# Altium schematic sheet Power.SchDoc
size A3; DocumentNumber: 8; SheetNumber: 8; SheetTotal: 8
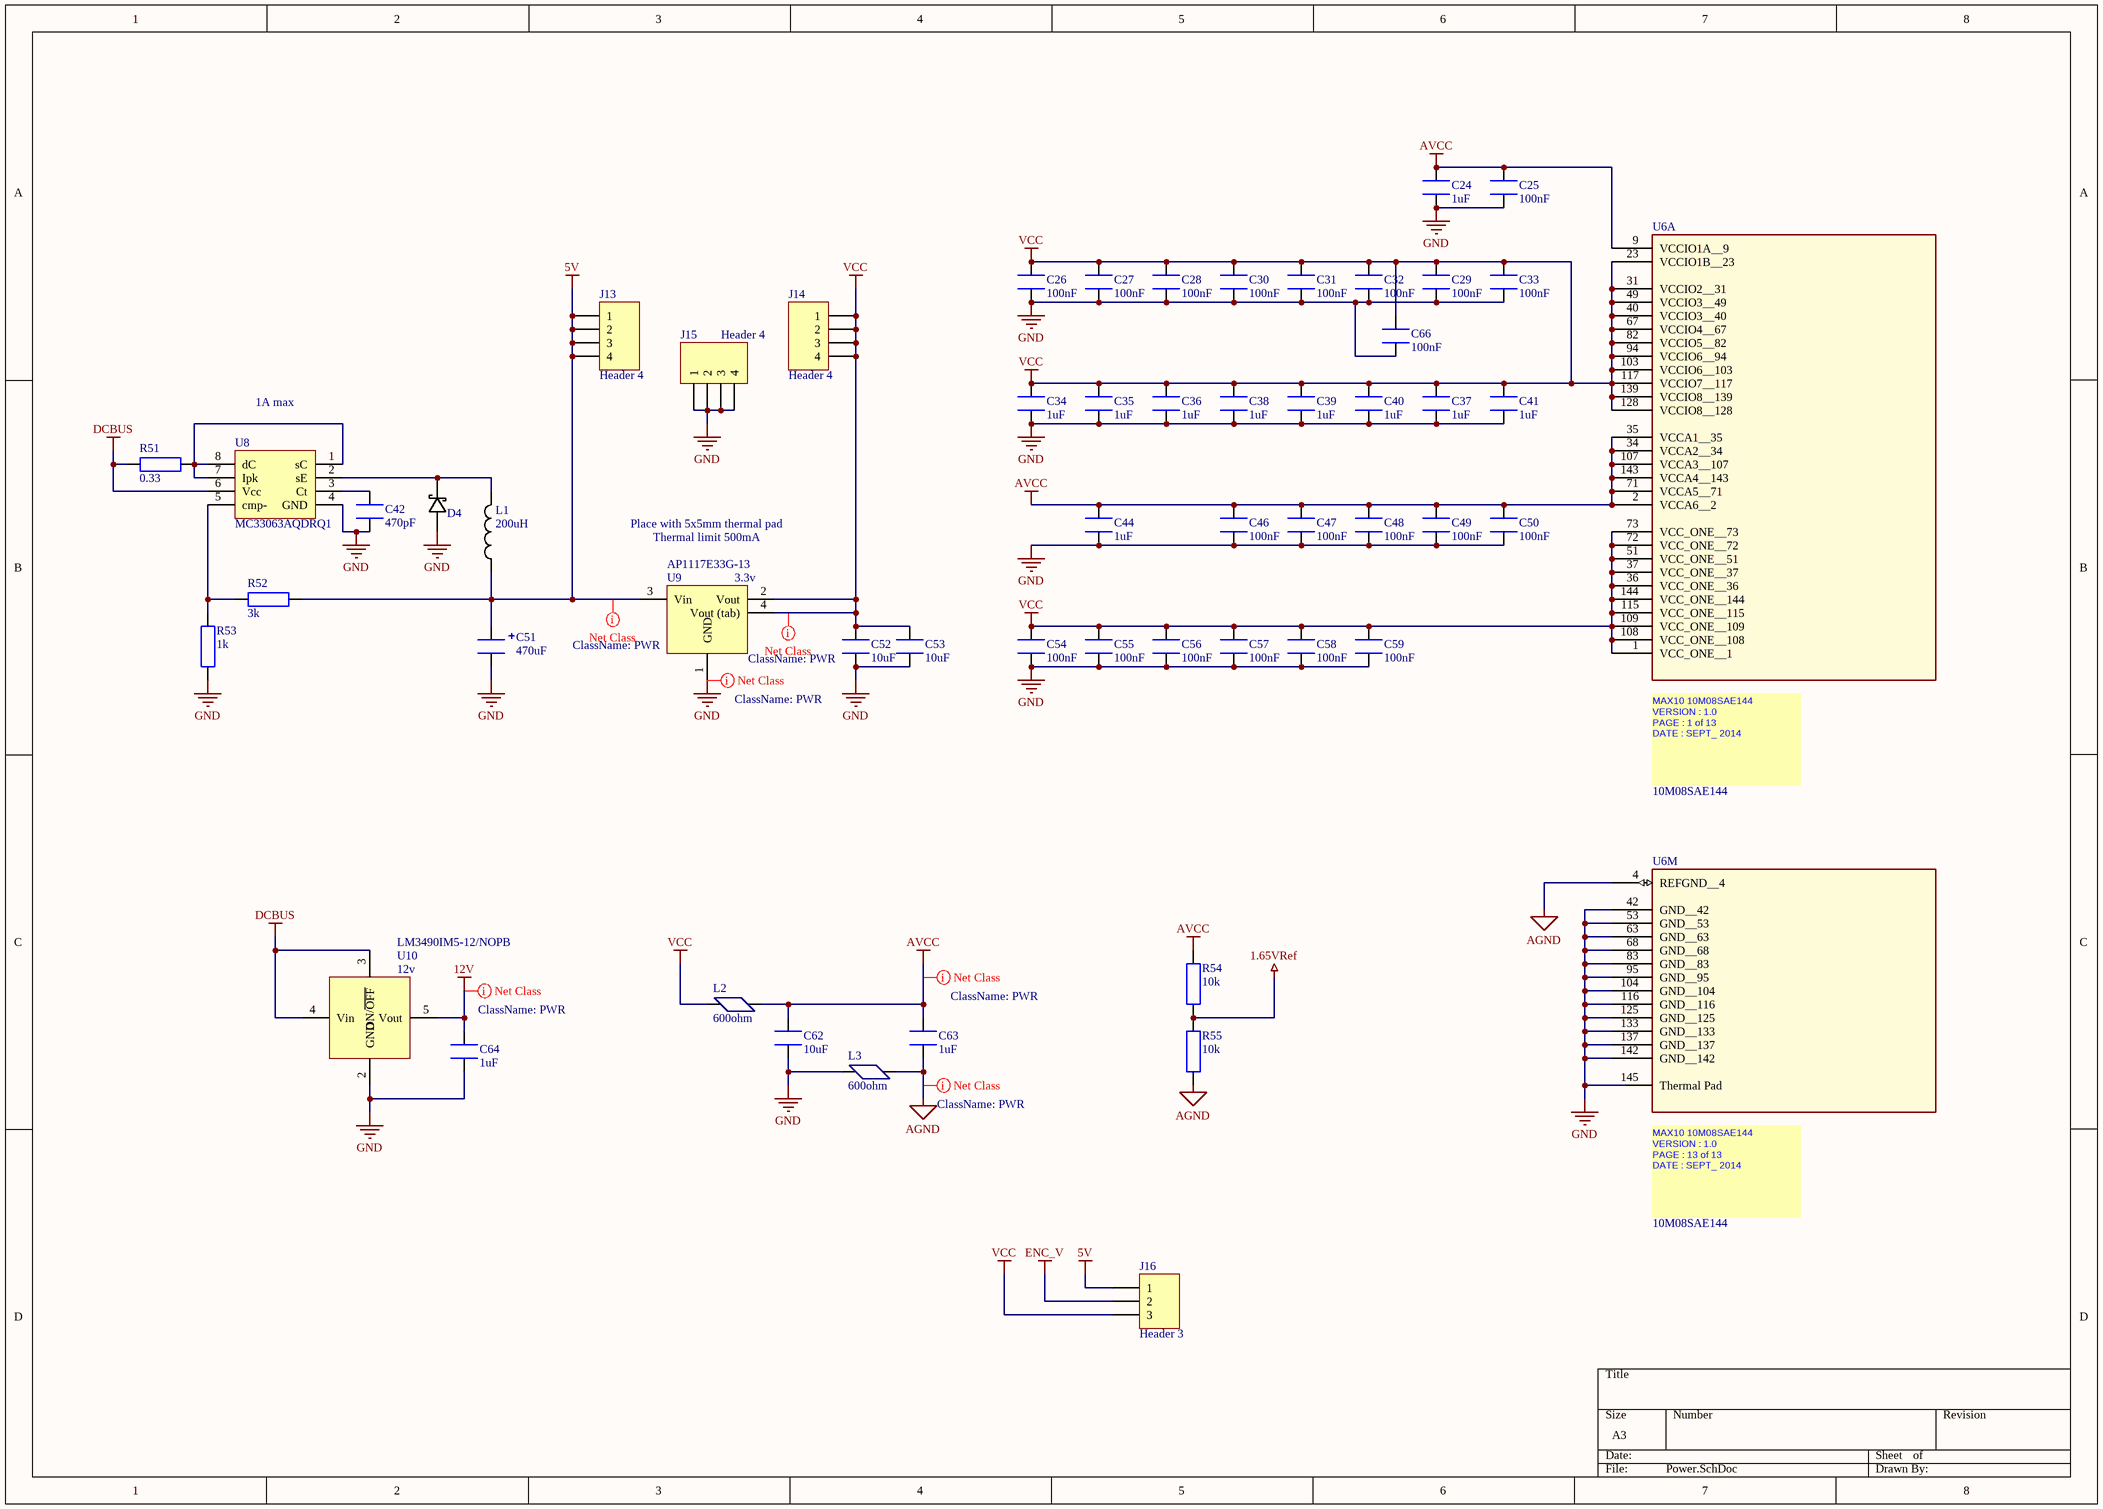
[diagram p0: Power.SchDoc]

## Parts
C24  value 1uF  [1608[0603]]  (hidden comment: MC0603X105K160)
C25  value 100nF  [1608[0603]]  (hidden comment: MC0603B104K160CT)
C26  value 100nF  [1608[0603]]  (hidden comment: MC0603B104K160CT)
C27  value 100nF  [1608[0603]]  (hidden comment: MC0603B104K160CT)
C28  value 100nF  [1608[0603]]  (hidden comment: MC0603B104K160CT)
C29  value 100nF  [1608[0603]]  (hidden comment: MC0603B104K160CT)
C30  value 100nF  [1608[0603]]  (hidden comment: MC0603B104K160CT)
C31  value 100nF  [1608[0603]]  (hidden comment: MC0603B104K160CT)
C32  value 100nF  [1608[0603]]  (hidden comment: MC0603B104K160CT)
C33  value 100nF  [1608[0603]]  (hidden comment: MC0603B104K160CT)
C34  value 1uF  [1608[0603]]  (hidden comment: MC0603X105K160)
C35  value 1uF  [1608[0603]]  (hidden comment: MC0603X105K160)
C36  value 1uF  [1608[0603]]  (hidden comment: MC0603X105K160)
C37  value 1uF  [1608[0603]]  (hidden comment: MC0603X105K160)
C38  value 1uF  [1608[0603]]  (hidden comment: MC0603X105K160)
C39  value 1uF  [1608[0603]]  (hidden comment: MC0603X105K160)
C40  value 1uF  [1608[0603]]  (hidden comment: MC0603X105K160)
C41  value 1uF  [1608[0603]]  (hidden comment: MC0603X105K160)
C42  value 470pF  [1608[0603]]  (hidden comment: MC0603B471K500CT)
C44  value 1uF  [1608[0603]]  (hidden comment: MC0603X105K160)
C46  value 100nF  [1608[0603]]  (hidden comment: MC0603B104K160CT)
C47  value 100nF  [1608[0603]]  (hidden comment: MC0603B104K160CT)
C48  value 100nF  [1608[0603]]  (hidden comment: MC0603B104K160CT)
C49  value 100nF  [1608[0603]]  (hidden comment: MC0603B104K160CT)
C50  value 100nF  [1608[0603]]  (hidden comment: MC0603B104K160CT)
C51  value 470uF  [CAP_ELEC_SIZE_G]  (hidden comment: EEE1CA471P)
C52  value 10uF  [CAPC2012X135N]  (hidden comment: MC0805F106Z100CT)
C53  value 10uF  [CAPC2012X135N]  (hidden comment: MC0805F106Z100CT)
C54  value 100nF  [1608[0603]]  (hidden comment: MC0603B104K160CT)
C55  value 100nF  [1608[0603]]  (hidden comment: MC0603B104K160CT)
C56  value 100nF  [1608[0603]]  (hidden comment: MC0603B104K160CT)
C57  value 100nF  [1608[0603]]  (hidden comment: MC0603B104K160CT)
C58  value 100nF  [1608[0603]]  (hidden comment: MC0603B104K160CT)
C59  value 100nF  [1608[0603]]  (hidden comment: MC0603B104K160CT)
C62  value 10uF  [CAPC2012X135N]  (hidden comment: MC0805F106Z100CT)
C63  value 1uF  [1608[0603]]  (hidden comment: MC0603X105K160)
C64  value 1uF  [1608[0603]]  (hidden comment: MC0603X105K160)
C66  value 100nF  [1608[0603]]  (hidden comment: MC0603B104K160CT)
D4  SS13B  [DO-214AA]  (value not drawn)
J13  Header 4  [HDR1X4]
J14  Header 4  [HDR1X4]
J15  Header 4  [HDR1X4]
J16  Header 3  [HDR1X3]
L1  value 200uH  [Inductor 12x12mm]  (hidden comment: MCSDRH125B-221MHF)
L2  value 600ohm  [FBC2012N]  (hidden comment: 2508056017Y2)
L3  value 600ohm  [FBC2012N]  (hidden comment: 2508056017Y2)
R51  value 0.33  [RESC1608X55N]  (hidden comment: ERJ3RQFR33V)
R52  value 3k  [RESC1608X55N]  (hidden comment: MCMR06X3001FTL)
R53  value 1k  [RESC1608X55N]  (hidden comment: MCMR06X1001FTL)
R54  value 10k  [RESC1608X06L]  (hidden comment: MCMR06X1002FTL)
R55  value 10k  [RESC1608X06L]  (hidden comment: MCMR06X1002FTL)
U6  10M08SAE144  [SQFP50P2200X2200X165_HS-145N]  (parts A,M of 13)
U8  MC33063AQDRQ1  [SO8_N]
U9  AP1117E33G-13  value 3.3v  [SOT223]
U10  LM3490IM5-12/NOPB  value 12v  [SOT23-5]

## Nets
1.65VRef: R54.1 R55.2
5V: C51.1 J13.1 J13.2 J13.3 J13.4 J16.1 L1.1 R52.1 U9.3(Vin)
12V: C64.2 U10.5(Vout)
AGND: C63.1 L3.1 R55.1 U6.4(REFGND__4)
AVCC: C24.2 C25.2 C44.2 C46.2 C47.2 C48.2 C49.2 C50.2 C62.2 C63.2 L2.1 R54.2 U6.2(VCCA6__2) U6.9(VCCIO1A__9) U6.34(VCCA2__34) U6.35(VCCA1__35) U6.71(VCCA5__71) U6.107(VCCA3__107) U6.143(VCCA4__143)
DCBUS: R51.2 U8.6(Vcc) U10.3(ON/~{OFF}) U10.4(Vin)
ENC_V: J16.2
GND: C24.1 C25.1 C26.1 C27.1 C28.1 C29.1 C30.1 C31.1 C32.1 C33.1 C34.1 C35.1 C36.1 C37.1 C38.1 C39.1 C40.1 C41.1 C42.1 C44.1 C46.1 C47.1 C48.1 C49.1 C50.1 C51.2 C52.1 C53.1 C54.1 C55.1 C56.1 C57.1 C58.1 C59.1 C62.1 C64.1 C66.1 D4.A J15.1 J15.2 J15.3 J15.4 L3.2 R53.1 U6.42(GND__42) U6.53(GND__53) U6.63(GND__63) U6.68(GND__68) U6.83(GND__83) U6.95(GND__95) U6.104(GND__104) U6.116(GND__116) U6.125(GND__125) U6.133(GND__133) U6.137(GND__137) U6.142(GND__142) U6.145(Thermal_Pad) U8.4(GND) U9.1(GND) U10.2(GND)
VCC: C26.2 C27.2 C28.2 C29.2 C30.2 C31.2 C32.2 C33.2 C34.2 C35.2 C36.2 C37.2 C38.2 C39.2 C40.2 C41.2 C52.2 C53.2 C54.2 C55.2 C56.2 C57.2 C58.2 C59.2 C66.2 J14.1 J14.2 J14.3 J14.4 J16.3 L2.2 U6.1(VCC_ONE__1) U6.23(VCCIO1B__23) U6.31(VCCIO2__31) U6.36(VCC_ONE__36) U6.37(VCC_ONE__37) U6.40(VCCIO3__40) U6.49(VCCIO3__49) U6.51(VCC_ONE__51) U6.67(VCCIO4__67) U6.72(VCC_ONE__72) U6.73(VCC_ONE__73) U6.82(VCCIO5__82) U6.94(VCCIO6__94) U6.103(VCCIO6__103) U6.108(VCC_ONE__108) U6.109(VCC_ONE__109) U6.115(VCC_ONE__115) U6.117(VCCIO7__117) U6.128(VCCIO8__128) U6.139(VCCIO8__139) U6.144(VCC_ONE__144) U9.2(Vout) U9.4(Vout_(tab))
NetC42_2: C42.2 U8.3(Ct)
NetD4_K: D4.K L1.2 U8.2(sE)
NetR51_1: R51.1 U8.1(sC) U8.7(Ipk) U8.8(dC)
NetR52_2: R52.2 R53.2 U8.5(cmp-)

## Layout directives
net class PWR: 5V, 12V, AGND, AVCC, GND, VCC

## Notes on the sheet
- 1A max
- Place with 5x5mm thermal pad
- Thermal limit 500mA
- (in symbol 10M08SAE144, part A) MAX10 10M08SAE144 / VERSION : 1.0 / PAGE : 1 of 13 / DATE : SEPT_ 2014 /
- (in symbol 10M08SAE144, part M) MAX10 10M08SAE144 / VERSION : 1.0 / PAGE : 13 of 13 / DATE : SEPT_ 2014 /

## Library data of the parts
C24 C34-C41 C44 C63 C64 = MC0603X105K160: CAP, MLCC, X5R, 1UF, 16V, 0603; Supplier 1: Farnell; Supplier Part Number 1: 2310630; Supplier 2: Farnell; Supplier Part Number 2: 1759407RL; Supplier 3: Farnell; Supplier Part Number 3: 1759407
C25-C33 C46-C50 C54-C59 C66 = MC0603B104K160CT: CAP, MLCC, X7R, 100NF, 16V, 0603; Supplier 1: Farnell; Supplier Part Number 1: 2310628; Supplier 2: Farnell; Supplier Part Number 2: 1759016RL; Supplier 3: Farnell; Supplier Part Number 3: 1759016
C42 = MC0603B471K500CT: CAP, MLCC, X7R, 470PF, 50V, 0603; Supplier 1: Farnell; Supplier Part Number 1: 1759079RL; Supplier 2: Farnell; Supplier Part Number 2: 2310617; Supplier 3: Farnell; Supplier Part Number 3: 1759079
C51 = EEE1CA471P: CAP, ALU ELEC, 470UF, 16V, SMD; Supplier 1: Farnell; Supplier Part Number 1: 2326123RL; Supplier 2: Farnell; Supplier Part Number 2: 2326123
C52 C53 C62 = MC0805F106Z100CT: CAP, MLCC, Y5V, 10UF, 0805; Supplier 1: Farnell; Supplier Part Number 1: 2408565; Supplier 2: Farnell; Supplier Part Number 2: 1759421; Supplier 3: Farnell; Supplier Part Number 3: 1759421RL; Supplier 4: Farnell; Supplier Part Number 4: 1760155
D4 = SS13B: DIODE, SCHOTTK, RECTIF, 1A, 30V, SMB; Supplier 1: Farnell; Supplier Part Number 1: 1861425
J13-J15 = Header 4: Header, 4-Pin; LatestRevisionDate: 17-Jul-2002; LatestRevisionNote: Re-released for DXP Platform.; Publisher: Altium Limited
J16 = Header 3: Header, 3-Pin; LatestRevisionDate: 17-Jul-2002; LatestRevisionNote: Re-released for DXP Platform.; Publisher: Altium Limited
L1 = MCSDRH125B-221MHF: INDUCTOR, 220µH, 20%, 2PINS; Supplier 1: Farnell; Supplier Part Number 1: 1864461RL; Supplier 2: Farnell; Supplier Part Number 2: 1864461
L2 L3 = 2508056017Y2: FERRITE BEAD, 0.1OHM, 2A, 0805; Supplier 1: Farnell; Supplier 2: Farnell; Supplier Part Number 1: 1838838; Supplier Part Number 2: 1838838RL
R51 = ERJ3RQFR33V: RESISTOR, 0603, 0.1W, 1%, 0R33; Supplier 1: Farnell; Supplier Part Number 1: 1717766RL; Supplier 2: Farnell; Supplier Part Number 2: 1717766
R52 = MCMR06X3001FTL: RESISTOR, 0603, 3K, 1%, ANTI SULFUR; Supplier 1: Farnell; Supplier Part Number 1: 2073461; Supplier 2: Farnell; Supplier Part Number 2: 2073461RL
R53 = MCMR06X1001FTL: RESISTOR, CERAMIC, 1K, 0.1W, 1%; Supplier 1: Farnell; Supplier Part Number 1: 2073348; Supplier 2: Farnell; Supplier Part Number 2: 2073348RL
R54 R55 = MCMR06X1002FTL: Resistor, 10k, 0603; Supplier 1: Farnell; Supplier Part Number 1: 2073349; Supplier 2: Farnell; Supplier Part Number 2: 2073349RL
U6 = 10M08SAE144: SWAP_INFO: (S1+S2+S3+S4+S5+S6+S7+S8+S9+S10+S11+S12+S13); SPLIT_INST: TRUE
U8 = MC33063AQDRQ1: DC-DC CONV, BOOST/BUCK/INVERTING, SOIC-8; Supplier 1: Farnell; Supplier Part Number 1: 2323541
U9 = AP1117E33G-13: IC, LDO, REG, 3.3V, SOT223; Supplier 1: Farnell; Supplier 2: Farnell; Supplier Part Number 1: 1825291RL; Supplier Part Number 2: 1825291
U10 = LM3490IM5-12/NOPB: LDO, FIXED, 12V, 0.1A, SOT-23-5; Supplier 1: Farnell; Supplier Part Number 1: 2382985